# Altium schematic sheet PG14_ POWER CONTROL.SchDoc: BMU - Charge Controller
size B; Address1: 3511 EDISON WAY; Address2: MENLO PARK, CA, 94025; Revision: 4.1; SheetNumber: 9; SheetTotal: 9
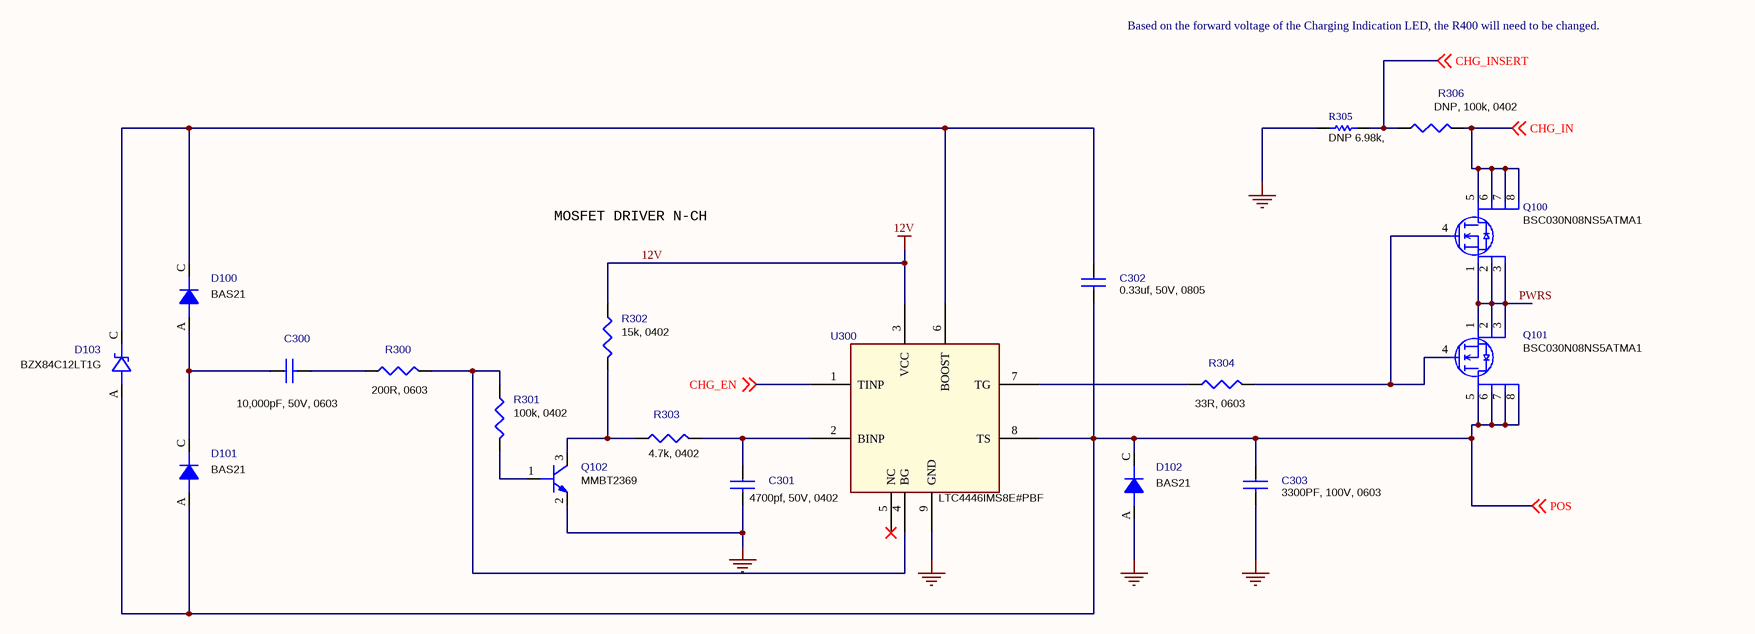
[diagram p0: PG14_ POWER CONTROL.SchDoc]

## Parts
C300  10,000pF, 50V, 0603  [C0603]
C301  4700pf, 50V, 0402  [C0402]
C302  0.33uf, 50V, 0805  [C0805]
C303  3300PF, 100V, 0603  [C0603]
D100  BAS21  [BAS21]
D101  BAS21  [BAS21]
D102  BAS21  [BAS21]
D103  BZX84C12LT1G  [SOT23-3]
Q100  BSC030N08NS5ATMA1  [8TDSON]
Q101  BSC030N08NS5ATMA1  [8TDSON]
Q102  MMBT2369  [SOT-23-3]
R300  200R, 0603  [R0603]
R301  100k, 0402  [R0402]
R302  15k, 0402  [R0402]
R303  4.7k, 0402  [R0402]
R304  33R, 0603  [R0603]
R305  DNP 6.98k,  [R0402]  (no BOM)
R306  DNP, 100k, 0402  [R0402]  (no BOM)
U300  LTC4446IMS8E#PBF  [8-MSOP]

## Nets
12V: R302.1 U300.3(VCC)
GND: C301.2 C303.2 D102.A(ANODE) Q102.2(E) R305.1 U300.9(GND)
CHG_EN: U300.1(TINP) ; off-sheet CHG_EN
CHG_IN: Q100.5(D1) Q100.6(D2) Q100.7(D3) Q100.8(D4) R306.2 ; off-sheet CHG_IN
CHG_INSERT: R305.2 R306.1 ; off-sheet CHG_INSERT
POS: C302.2 C303.1 D101.A(ANODE) D102.C(CATHODE) D103.A(ANODE) Q101.5(D1) Q101.6(D2) Q101.7(D3) Q101.8(D4) U300.8(TS) ; off-sheet POS
PWRS: Q100.1(S1) Q100.2(S2) Q100.3(S3) Q101.1(S1) Q101.2(S2) Q101.3(S3)
NetC300_1: C300.1 D100.A(ANODE) D101.C(CATHODE)
NetC300_2: C300.2 R300.1
NetC301_1: C301.1 R303.2 U300.2(BINP)
NetC302_1: C302.1 D100.C(CATHODE) D103.C(CATHODE) U300.6(BOOST)
NetQ100_4: Q100.4(G) Q101.4(G) R304.2
NetQ102_1: Q102.1(B) R301.2
NetQ102_3: Q102.3(C) R302.2 R303.1
NetR300_2: R300.2 R301.1 U300.4(BG)
NetR304_1: R304.1 U300.7(TG)

Not connected (* = marked no-connect by the designer): U300 5(NC)*

## Notes on the sheet
- Based on the forward voltage of the Charging Indication LED, the R400 will need to be changed.
- MOSFET DRIVER N-CH
- Title
- Size:
- Date:
- B
- Number:
- Time:
- Revision:
- Sheet
- of
- MATTERNET
- 161 E. Evelyn Ave.
- Mountain View,
- CA 94041 USA
- PROPRIETRY & CONFIDENTIAL
  THE INFORMATION CONTAINS IN THIS DRAWING
  IS THE SOLE PROPERTY OF  MATTERNET Inc.
  ANY REPRODUCTION IN PART OR AS WHOLE
  WITHOUT A WRITTEN PERMISSION OF
  MATTERNET Inc. IS PROHIBITED
- File:

## Library data of the parts
C300 = CAP-Generic-0603: CAP CER 10000PF 50V X7R 0603; Manufacturer: TDK; Manufacturer Part Number: CGA3E2X7R1H103K080AE; Capacitance: 10nF; Tolerance: 10%; Supplier 1: Digi-Key; Supplier Part Number 1: 445-15955-1-ND; Stock 1: 42633; Pricing 1: 1=0.27, 10=0.186, 100=0.0944, 500=0.06458, 1000=0.05713 (USD); Mount: Surface Mount; Case/Package: 0603; Weight: 7.1E-05oz; Case Code (Metric): 1608; Case Code (Imperial): 0603; Min Operating Temperature: -55°C; Max Operating Temperature: 125°C; Package Quantity: 4000; Packaging: Tape and Reel; Voltage Rating: 50V; Dielectric: X7R; Termination: SMD/SMT; Voltage Rating (DC): 50V; Features: Soft Termination; Length: 0.063inch; Height: 0.8mm; Width: 0.031inch; Thickness: 0.035inch; Ratings: AEC-Q200
C301 = CAP-Generic-0402: CAP CER 4700PF 50V X7R 0402; Manufacturer: TDK; Manufacturer Part Number: CGA2B2X7R1H472K050BE; Capacitance: 4.7nF; Tolerance: 10%; Supplier 1: Digi-Key; Supplier Part Number 1: 445-173711-1-ND; Stock 1: 0; Pricing 1: 1=0.22, 10=0.153, 100=0.072, 500=0.0505, 1000=0.04181, 2500=0.03892, 5000=0.0356 (USD); Mount: Surface Mount; Case/Package: 0402; Case Code (Metric): 1005; Case Code (Imperial): 0402; Min Operating Temperature: -55°C; Max Operating Temperature: 125°C; Packaging: Tape and Reel; Voltage Rating: 50V; Features: Soft Termination; Length: 0.039inch; Width: 0.02inch; Thickness: 0.024inch; Ratings: AEC-Q200; Supplier 2: Mouser; Supplier Part Number 2: 810-CGA2B2X7R1H472KB; Stock 2: 8705; Pricing 2: 1=0.18, 10=0.07, 50=0.07, 100=0.048, 1000=0.034, 10000=0.024 (USD)
C302 = CAP-Generic-0603: CAP CER 0.33UF 50V X7R 0805; Manufacturer: KEMET; Manufacturer Part Number: C0805X334K5RACAUTO; Dielectric Material: Ceramic; Tolerance: 10%; Capacitance: 330nF; Supplier 1: Digi-Key; Supplier Part Number 1: 399-16458-1-ND; Stock 1: 18140; Pricing 1: 1=1.05, 10=0.795, 100=0.5685, 500=0.44016, 1000=0.37903 (USD); Mount: Surface Mount; Case/Package: 0805; Contact Plating: Matte,Tin; Min Operating Temperature: -55°C; Max Operating Temperature: 125°C; Packaging: Tape and Reel; Dielectric: X7R; Voltage Rating (DC): 50V; Termination: Wraparound; Length: 2.1mm; Depth: 1.25mm; Supplier 2: Mouser; Supplier Part Number 2: 80-C0805X334K5RAUTO; Stock 2: 4254; Pricing 2: 10000=0.354 (USD)
C303 = CAP-Generic-0402: CAP CER 3300PF 100V X7R 0603; Manufacturer: Murata; Manufacturer Part Number: GCJ188R72A332KA01D; Capacitance: 3.3nF; Tolerance: 10%; Supplier 1: Digi-Key; Supplier Part Number 1: 490-5774-1-ND; Stock 1: 7162; Pricing 1: 1=0.29, 10=0.199, 100=0.101, 500=0.06908, 1000=0.06111 (USD); Mount: Surface Mount; Case/Package: 0603; Case Code (Imperial): 0603; Case Code (Metric): 1608; Min Operating Temperature: -55°C; Max Operating Temperature: 125°C; Packaging: Tape and Reel; Package Quantity: 1; Voltage Rating: 100V; Termination: SMD/SMT; Voltage Rating (DC): 100V; Features: Soft Termination; Length: 0.063inch; Width: 0.031inch; Thickness: 0.031inch; Ratings: AEC-Q200; ComponentLink1URL: http://www.murata.com/~/media/webrenewal/support/library/catalog/products/capacitor/mlcc/c03e.ashx?src-supplier=Digi-Key; ComponentLink1Description: http://www.murata.com/~/media/webrenewal/support/library/catalog/products/capacitor/mlcc/c03e.ashx?src-supplier=Digi-Key; ComponentLink2URL: http://psearch.en.murata.com/capacitor/product/GCJ188R72A332KA01%23.pdf?src-supplier=Digi-Key; ComponentLink2Description: http://psearch.en.murata.com/capacitor/product/GCJ188R72A332KA01%23.pdf?src-supplier=Digi-Key; Supplier 2: Mouser; Supplier Part Number 2: 81-GCJ188R72A332KA1D; Stock 2: 6900; Pricing 2: 1=0.29, 10=0.199, 50=0.199, 100=0.101, 1000=0.062, 10000=0.047 (USD)
D100-D102 = DIO-GENERIC: DIODE GEN PURP 250V 200MA SOT23; Manufacturer: Vishay; Manufacturer Part Number: BAS21-HE3-08; Forward Voltage: 1.25V; Peak Non-Repetitive Surge Current: 2.5A; Reverse Recovery Time: 50ns; Element Configuration: Single; ComponentLink1URL: http://www.farnell.com/datasheets/2284536.pdf; ComponentLink1Description: http://www.farnell.com/datasheets/2284536.pdf; ComponentLink2URL: http://www.mouser.com/ds/2/149/BAS21-106636.pdf; ComponentLink2Description: http://www.mouser.com/ds/2/149/BAS21-106636.pdf; ComponentLink3URL: http://www.fairchildsemi.com/ds/BA/BAS21.pdf; ComponentLink3Description: http://www.fairchildsemi.com/ds/BA/BAS21.pdf; ComponentLink4URL: https://www.fairchildsemi.com/datasheets/BA/BAS21.pdf; ComponentLink4Description: https://www.fairchildsemi.com/datasheets/BA/BAS21.pdf; ComponentLink5URL: https://www.fairchildsemi.com/package-drawings/MA/MA03B.pdf; ComponentLink5Description: https://www.fairchildsemi.com/package-drawings/MA/MA03B.pdf; Supplier 1: Digi-Key; Supplier Part Number 1: BAS21-HE3-08GICT-ND; Stock 1: 8900; Pricing 1: 1=0.25, 10=0.208, 100=0.1104, 500=0.0726, 1000=0.04937 (USD); Mount: Surface Mount; Case/Package: SOT-23; Number of Pins: 3; Weight: 0.00031oz; Contact Plating: Tin; Min Operating Temperature: -55°C; Max Operating Temperature: 150°C; Packaging: Tape and Reel; Package Quantity: 3000; Forward Current: 200mA; Max Repetitive Reverse Voltage (Vrrm): 250V; ComponentLink6URL: http://www.vishay.com/docs/85540/bas19.pdf?src-supplier=Avnet; ComponentLink6Description: http://www.vishay.com/docs/85540/bas19.pdf?src-supplier=Avnet; Supplier 2: Mouser; Supplier Part Number 2: 78-BAS21-HE3-08; Stock 2: 13675; Pricing 2: 1=0.25, 10=0.166, 50=0.166, 100=0.082, 1000=0.046, 10000=0.031 (USD)
D103 = DIO-ZENER-GENERIC: DIODE ZENER 12V 225MW SOT23-3; Manufacturer: ON Semiconductor; custprt: 100-0500-000065; custinv: Ansync; Option: AB; Material: Plastic; Forward Voltage: 900mV; Tolerance: 5%; Max Reverse Leakage Current: 100nA; Impedance: 25R; Power Dissipation: 300mW; Test Current: 5mA; Element Configuration: Single; Zener Current: 10mA; Breakdown Voltage: 12.7V; ESD Protection: Yes; Supplier 1: Digi-Key; Supplier Part Number 1: BZX84C12LT1GOSCT-ND; Manufacturer Part Number: BZX84C12LT1G; Stock 1: 0; Pricing 1: 1=0.15, 10=0.135, 100=0.0735, 500=0.04522, 1000=0.03084 (USD); Case/Package: SOT-23-3; Number of Pins: 3; Contact Plating: Matte,Tin; Min Operating Temperature: -65°C; Max Operating Temperature: 150°C; Packaging: Tape and Reel; Package Quantity: 3000; Max Power Dissipation: 225mW; Zener Voltage: 12V; Voltage Tolerance: 5%; Working Voltage: 12V; Peak Reverse Current: 100nA; Voltage Rating (DC): 12V; Power Rating: 225mW; Length: 2.9mm; Height: 0.94mm; Width: 1.3mm; Radiation Hardening: No; Lead Free: Lead Free; Halogen Free: Halogen Free; REACH SVHC: No SVHC; ComponentLink1URL: https://www.verical.com/server-webapp/html/getDatasheet?partID=38645; ComponentLink1Description: https://www.verical.com/server-webapp/html/getDatasheet?partID=38645; ComponentLink2URL: http://www.onsemi.com/pub_link/Collateral/BZX84C2V4LT1-D.PDF; ComponentLink2Description: http://www.onsemi.com/pub_link/Collateral/BZX84C2V4LT1-D.PDF; ComponentLink3URL: http://www.farnell.com/datasheets/1874542.pdf; ComponentLink3Description: http://www.farnell.com/datasheets/1874542.pdf; ComponentLink4URL: https://www.onsemi.com/pub/Collateral/BZX84C2V4LT1-D.PDF; ComponentLink4Description: https://www.onsemi.com/pub/Collateral/BZX84C2V4LT1-D.PDF; ComponentLink5URL: http://www.jameco.com/Jameco/Products/ProdDS/2010827.pdf; ComponentLink5Description: http://www.jameco.com/Jameco/Products/ProdDS/2010827.pdf; ComponentLink6URL: https://www.alliedelec.com/m/d/89a0f5fa5faf07909887b6182710b562.pdf; ComponentLink6Description: https://www.alliedelec.com/m/d/89a0f5fa5faf07909887b6182710b562.pdf; Supplier 2: Mouser; Supplier Part Number 2: 863-BZX84C12LT1G; Stock 2: 5126; Pricing 2: 1=0.14, 10=0.123, 50=0.123, 100=0.044, 1000=0.029, 10000=0.019 (USD)
Q100 Q101 = BSC030N08NS5ATMA1: MOSFET N-CH 80V 100A 8TDSON; Manufacturer: Infineon; Rds On Max: 3mR; Input Capacitance: 5.6nF; Max Power Dissipation: 2.5W; Gate to Source Voltage (Vgs): 20V; Turn-On Delay Time: 20ns; Rise Time: 12ns; Turn-Off Delay Time: 43ns; Fall Time: 13ns; Element Configuration: Single; Number of Channels: 1; Drain to Source Resistance: 4.5mR; Supplier 1: Digi-Key; Supplier Part Number 1: BSC030N08NS5ATMA1CT-ND; Manufacturer Part Number: BSC030N08NS5ATMA1; Stock 1: 0; Pricing 1: 1=2.41, 10=2.181, 100=1.7526, 500=1.36316, 1000=1.12947 (USD); Mount: Surface Mount; Number of Pins: 8; Weight: 0.01787oz; Min Operating Temperature: -55°C; Max Operating Temperature: 150°C; Packaging: Tape and Reel; Drain to Source Voltage (Vdss): 80V; Continuous Drain Current (ID): 100A; Drain to Source Breakdown Voltage: 80V; Package Quantity: 5000; Max Dual Supply Voltage: 80V; Lead Free: Contains Lead; Halogen Free: Halogen Free; Supplier 2: Mouser; Supplier Part Number 2: 726-BSC030N08NS5ATMA; Stock 2: 0; Pricing 2: 1=2.03, 10=1.72, 50=1.72, 100=1.38, 1000=0.997, 10000=0.894 (USD); Supplier 3: Newark; Supplier Part Number 3: 12AC9442; Stock 3: 3452; Pricing 3: 1=2.03, 10=1.72, 25=1.61, 50=1.49, 100=1.38, 250=1.3, 500=1.21, 1000=0.997 (USD)
Q102 = Trans-Generic_4: TRANS NPN 15V 0.2A SOT-23; Manufacturer: ON Semiconductor / Fairchild; Manufacturer Part Number: MMBT2369A; custprt: 100-0880-000032; custinv: Ansync; PspiceTemplate: Q^@REFDES %C %B %E; Option: AB; Max Power Dissipation: 225mW; Collector Base Voltage (VCBO): 40V; Max Collector Current: 200mA; hFE Min: 40; Emitter Base Voltage (VEBO): 4.5V; Collector Emitter Saturation Voltage: 500mV; Element Configuration: Single; Number of Elements: 1; Supplier 1: Digi-Key; Supplier Part Number 1: MMBT2369ACT-ND; Stock 1: 0; Mount: Surface Mount; Case/Package: SOT-23; Number of Pins: 3; Weight: 0.03g; Contact Plating: Matte,Tin; Min Operating Temperature: -55°C; Max Operating Temperature: 150°C; Packaging: Tape and Reel; Collector Emitter Voltage (VCEO): 15V; Polarity: NPN; Package Quantity: 3000; Collector Emitter Breakdown Voltage: 15V; Power Dissipation: 225mW; Voltage Rating (DC): 15V; Current Rating: 200mA; Max Breakdown Voltage: 15V; Length: 2.9mm; Height: 0.97mm; Width: 1.3mm; Radiation Hardening: No; Lead Free: Lead Free; REACH SVHC: No SVHC; ComponentLink1URL: http://www.farnell.com/datasheets/1874916.pdf; ComponentLink1Description: http://www.farnell.com/datasheets/1874916.pdf; ComponentLink2URL: http://www.mouser.com/ds/2/149/MMBT2369A-195770.pdf; ComponentLink2Description: http://www.mouser.com/ds/2/149/MMBT2369A-195770.pdf; ComponentLink3URL: https://www.verical.com/server-webapp/html/getDatasheet?partID=110154; ComponentLink3Description: https://www.verical.com/server-webapp/html/getDatasheet?partID=110154; ComponentLink4URL: http://www.fairchildsemi.com/datasheets/MM/MMBT2369A.pdf; ComponentLink4Description: http://www.fairchildsemi.com/datasheets/MM/MMBT2369A.pdf; ComponentLink5URL: https://www.fairchildsemi.com/package-drawings/MA/MA03B.pdf; ComponentLink5Description: https://www.fairchildsemi.com/package-drawings/MA/MA03B.pdf; ComponentLink6URL: http://www.jameco.com/Jameco/Products/ProdDS/213946.pdf; ComponentLink6Description: http://www.jameco.com/Jameco/Products/ProdDS/213946.pdf; ComponentLink7URL: http://www.fairchildsemi.com/ds/MM/MMBT2369A.pdf; ComponentLink7Description: http://www.fairchildsemi.com/ds/MM/MMBT2369A.pdf; ComponentLink8URL: https://www.fairchildsemi.com/datasheets/MM/MMBT2369A.pdf; ComponentLink8Description: https://www.fairchildsemi.com/datasheets/MM/MMBT2369A.pdf; Supplier 2: Mouser; Supplier Part Number 2: 512-MMBT2369A; Stock 2: 0; Supplier 3: Digi-Key; Supplier Part Number 3: MMBT2369LT1GOSCT-ND; Stock 3: 41555; Pricing 3: 1=0.21, 10=0.187, 100=0.1021, 500=0.06284, 1000=0.04284 (USD); ComponentLink9URL: https://www.verical.com/server-webapp/html/getDatasheet?partID=74294; ComponentLink9Description: https://www.verical.com/server-webapp/html/getDatasheet?partID=74294; ComponentLink10URL: http://www.onsemi.com/pub/Collateral/MMBT2369LT1-D.PDF; ComponentLink10Description: http://www.onsemi.com/pub/Collateral/MMBT2369LT1-D.PDF; ComponentLink11URL: http://www.farnell.com/datasheets/1840565.pdf; ComponentLink11Description: http://www.farnell.com/datasheets/1840565.pdf; ComponentLink12URL: http://www.onsemi.com/pub_link/Collateral/MMBT2369LT1-D.PDF; ComponentLink12Description: http://www.onsemi.com/pub_link/Collateral/MMBT2369LT1-D.PDF
R300 = R-Generic-0603: RES SMD 200 OHM 1% 1/10W 0603; Manufacturer: Yageo; Manufacturer Part Number: AC0603FR-07200RL; custprt: 100-0110-000074; custinv: Ansync; Option: AB; Max Power Dissipation: 100mW; Temperature Coefficient: 100ppm/°C; Supplier 1: Digi-Key; Supplier Part Number 1: YAG3576CT-ND; Stock 1: 46237; Pricing 1: 1=0.1, 10=0.032, 100=0.0129, 1000=0.00579, 2500=0.00502 (USD); Case/Package: 0603; Case Code (Metric): 1608; Case Code (Imperial): 0603; Min Operating Temperature: -55°C; Max Operating Temperature: 155°C; Packaging: Tape and Reel; Resistance: 200R; Composition: Thick Film; Number of Terminations: 2; Tolerance: 1%; Features: Automotive AEC-Q200,Moisture Resistant; Length: 0.063inch; Height: 0.022inch; Width: 0.031inch
R301 R306 = R-Generic-0402: RES SMD 100K OHM 1% 1/16W 0402; Manufacturer: Yageo; Manufacturer Part Number: RC0402FR-07100KL; custinv: Ansync; custprt: 100-0120-000011; Option: AB; Resistance: 100kR; Temperature Coefficient: 100ppm/°C; Power Rating: 63mW; Voltage Rating: 50V; Supplier 1: Digi-Key; Supplier Part Number 1: 311-100KLRCT-ND; Stock 1: 17114602; Pricing 1: 1=0.1, 10=0.018, 100=0.0073, 1000=0.00329, 2500=0.00286, 5000=0.00236 (USD); Case/Package: 0402; Case Code (Metric): 1005; Case Code (Imperial): 0402; Min Operating Temperature: -55°C; Max Operating Temperature: 155°C; Tolerance: 1%; Composition: Thick Film; Packaging: Tape and Reel; Package Quantity: 1; Number of Terminations: 2; Termination: SMD/SMT; Military Standard: Not; Max Power Dissipation: 63mW; Working Voltage: 50V; Features: Moisture Resistant; Length: 0.039inch; Height: 0.016inch; Width: 0.02inch; Depth: 0.5mm; REACH SVHC: No SVHC; Lead Free: Lead Free; ComponentLink1URL: http://www.yageo.com/documents/recent/PYu-RC_Group_51_RoHS_L_9.pdf; ComponentLink1Description: http://www.yageo.com/documents/recent/PYu-RC_Group_51_RoHS_L_9.pdf; ComponentLink2URL: http://www.farnell.com/datasheets/1018594.pdf; ComponentLink2Description: http://www.farnell.com/datasheets/1018594.pdf; ComponentLink3URL: http://www.yageo.com/documents/recent/PYu-RC_Group_51_RoHS_L_8.pdf; ComponentLink3Description: http://www.yageo.com/documents/recent/PYu-RC_Group_51_RoHS_L_8.pdf; ComponentLink4URL: http://documents.rs-components.com/techlib://itc_doclist_GB.htm?stockno=6185797; ComponentLink4Description: http://documents.rs-components.com/techlib://itc_doclist_GB.htm?stockno=6185797
R302 = R-Generic-0402: RES SMD 15K OHM 1% 1/16W 0402; Manufacturer: Yageo; Manufacturer Part Number: RC0402FR-0715KL; custinv: Ansync; custprt: 100-0120-000195; Option: AB; Power Rating: 62.5mW; Resistance: 15kR; Voltage Rating: 50V; Temperature Coefficient: 100ppm/°C; Max Power Dissipation: 63mW; Supplier 1: Digi-Key; Supplier Part Number 1: 311-15.0KLRCT-ND; Stock 1: 2807614; Pricing 1: 1=0.1, 10=0.018, 100=0.0073, 1000=0.00329, 2500=0.00286, 5000=0.00236 (USD); Case/Package: 0402; Number of Pins: 2; Weight: 2.3E-05oz; Case Code (Imperial): 0402; Case Code (Metric): 1005; Min Operating Temperature: -55°C; Max Operating Temperature: 155°C; Tolerance: 1%; Packaging: Tape and Reel; Package Quantity: 1; Termination: SMD/SMT; Composition: Thick Film; Number of Terminations: 2; Military Standard: Not; Voltage Rating (DC): 50V; Features: Moisture Resistant; Length: 1mm; Height: 0.016inch; Width: 0.5mm; Depth: 0.5mm; REACH SVHC: No SVHC; Lead Free: Lead Free; ComponentLink1URL: http://www.farnell.com/datasheets/1018594.pdf; ComponentLink1Description: http://www.farnell.com/datasheets/1018594.pdf; ComponentLink2URL: http://www.mouser.com/ds/2/447/PYu-RC0402_51_RoHS_L_6_r-8721.pdf; ComponentLink2Description: http://www.mouser.com/ds/2/447/PYu-RC0402_51_RoHS_L_6_r-8721.pdf; ComponentLink3URL: http://www.yageo.com/documents/recent/PYu-RC_Group_51_RoHS_L_9.pdf; ComponentLink3Description: http://www.yageo.com/documents/recent/PYu-RC_Group_51_RoHS_L_9.pdf; ComponentLink4URL: http://www.yageo.com/documents/recent/PYu-RC0402_51_RoHS_L_6_r.pdf; ComponentLink4Description: http://www.yageo.com/documents/recent/PYu-RC0402_51_RoHS_L_6_r.pdf
R303 = R-Generic-0402: RES SMD 4.7K OHM 1% 1/16W 0402; Manufacturer: Yageo; Manufacturer Part Number: RC0402FR-074K7L; custinv: Ansync; custprt: 100-0120-000181; Option: AB; Voltage Rating (DC): 50V; Power Rating: 62.5mW; Resistance: 4.7kR; Temperature Coefficient: 100ppm/°C; Supplier 1: Digi-Key; Supplier Part Number 1: 311-4.7KLRCT-ND; Stock 1: 1860042; Pricing 1: 1=0.1, 10=0.018, 100=0.0073, 1000=0.00329, 2500=0.00286, 5000=0.00236 (CHF); Case/Package: 0402; Number of Pins: 2; Case Code (Imperial): 0402; Case Code (Metric): 1005; Min Operating Temperature: -55°C; Max Operating Temperature: 155°C; Packaging: Tape and Reel; Tolerance: 1%; Voltage Rating: 50V; Composition: Thick Film; Termination: SMD/SMT; Military Standard: Not; Length: 1mm; Height: 0.32mm; Depth: 0.5mm; Width: 0.5mm; REACH SVHC: No SVHC; Lead Free: Lead Free; ComponentLink1URL: http://documents.rs-components.com/techlib://itc_doclist_GB.htm?stockno=6184558; ComponentLink1Description: http://documents.rs-components.com/techlib://itc_doclist_GB.htm?stockno=6184558; ComponentLink2URL: http://www.farnell.com/datasheets/1018594.pdf; ComponentLink2Description: http://www.farnell.com/datasheets/1018594.pdf; ComponentLink3URL: https://www.verical.com/server-webapp/html/getDatasheet?partID=328119; ComponentLink3Description: https://www.verical.com/server-webapp/html/getDatasheet?partID=328119; ComponentLink4URL: http://www.farnell.com/datasheets/1686128.pdf; ComponentLink4Description: http://www.farnell.com/datasheets/1686128.pdf
R304 = R-Generic-0603: RES SMD 33 OHM 1% 1/10W 0603; Manufacturer: Yageo; Manufacturer Part Number: AC0603FR-0733RL; custprt: 100-0110-000153; custinv: Ansync; Option: AB; Power Rating: 100mW; Voltage Rating: 50V; Temperature Coefficient: 100ppm/°C; Supplier 1: Digi-Key; Supplier Part Number 1: YAG3599CT-ND; Stock 1: 70551; Pricing 1: 1=0.1, 10=0.032, 100=0.0129, 1000=0.00579, 2500=0.00502 (USD); Case/Package: 0603; Case Code (Imperial): 0603; Case Code (Metric): 1608; Min Operating Temperature: -55°C; Max Operating Temperature: 155°C; Packaging: Tape and Reel; Resistance: 33R; Tolerance: 1%; Composition: Thick Film; Termination: SMD/SMT; Number of Terminations: 2; Max Power Dissipation: 100mW; Features: Automotive AEC-Q200,Moisture Resistant; Length: 0.063inch; Height: 0.022inch; Width: 0.8mm
R305 = Res1: Resistor; Published: 8-Jun-2000; LatestRevisionDate: 17-Jul-2002; LatestRevisionNote: Re-released for DXP Platform.; PackageReference: AXIAL-0.3; Publisher: Altium Limited; PackageDescription: Axial Device, Thru-Hole; 2 Leads; 0.3 in Pin Spacing; Value: 6.98k
U300 = IC-LTC4446IMS8EPBF-700-510: IC MOSFET DRIVER N-CH 8-MSOP; Manufacturer: Analog Devices / Linear Technology; custinv: Ansync; custprt: 100-0700-000510; Option: AB; Rise Time: 80ns; Propagation Delay: 45ns; Max Supply Voltage: 13.5V; Min Supply Voltage: 7.2V; Number of Outputs: 2; Fall Time: 50ns; Tolerance: 10%; Capacitance: 330nF; Voltage Rating: 35V; Dielectric: X7R; Supplier 1: Digi-Key; Supplier Part Number 1: LTC4446IMS8E#PBF-ND; Manufacturer Part Number: LTC4446IMS8E#PBF; Stock 1: 63; Pricing 1: 1=3.72, 25=2.642, 100=2.244 (USD); Case/Package: SOP; Number of Pins: 8; Min Operating Temperature: -40°C; Max Operating Temperature: 85°C; Package Quantity: 50; Packaging: Rail/Tube; Number of Drivers: 2; Turn-On Delay Time: 45ns; Lead Free: Lead Free; ComponentLink1URL: http://www.linear.com/docs/26389; ComponentLink1Description: http://www.linear.com/docs/26389; Supplier 2: Mouser; Supplier Part Number 2: 584-LTC4446IMS8E#PBF; Stock 2: 166; Pricing 2: 1=3.72, 10=3.41, 50=2.64, 100=2.24, 1000=2.24, 10000=2.24 (USD); Supplier 3: Digi-Key; Supplier Part Number 3: 445-6927-1-ND; Stock 3: 30585; Pricing 3: 1=0.3, 10=0.207, 100=0.1173, 500=0.0828, 1000=0.07245 (USD); Mount: Surface Mount; Weight: 7.1E-05oz; Case Code (Imperial): 0603; Case Code (Metric): 1608; Termination: SMD/SMT; Voltage Rating (DC): 35V; Composition: Ceramic; Length: 1.6mm; Height: 0.8mm; Width: 0.8mm; Thickness: 0.035inch; Depth: 0.8mm; Ratings: AEC-Q200; ComponentLink2URL: http://product.tdk.com/capacitor/mlcc/detailed_information.php?lang=en&amp;ref=jp&amp;part_no=CGA3E1X7R1V334K080AC; ComponentLink2Description: http://product.tdk.com/capacitor/mlcc/detailed_information.php?lang=en&amp;ref=jp&amp;part_no=CGA3E1X7R1V334K080AC